# EasyEDA schematic Sound Activation Detector.json
TITLE: Sheet_1; REV: 1.0; Date: 2021-08-31; Sheet: 1/1; Drawn By: confusedtx5; Company: Your Company
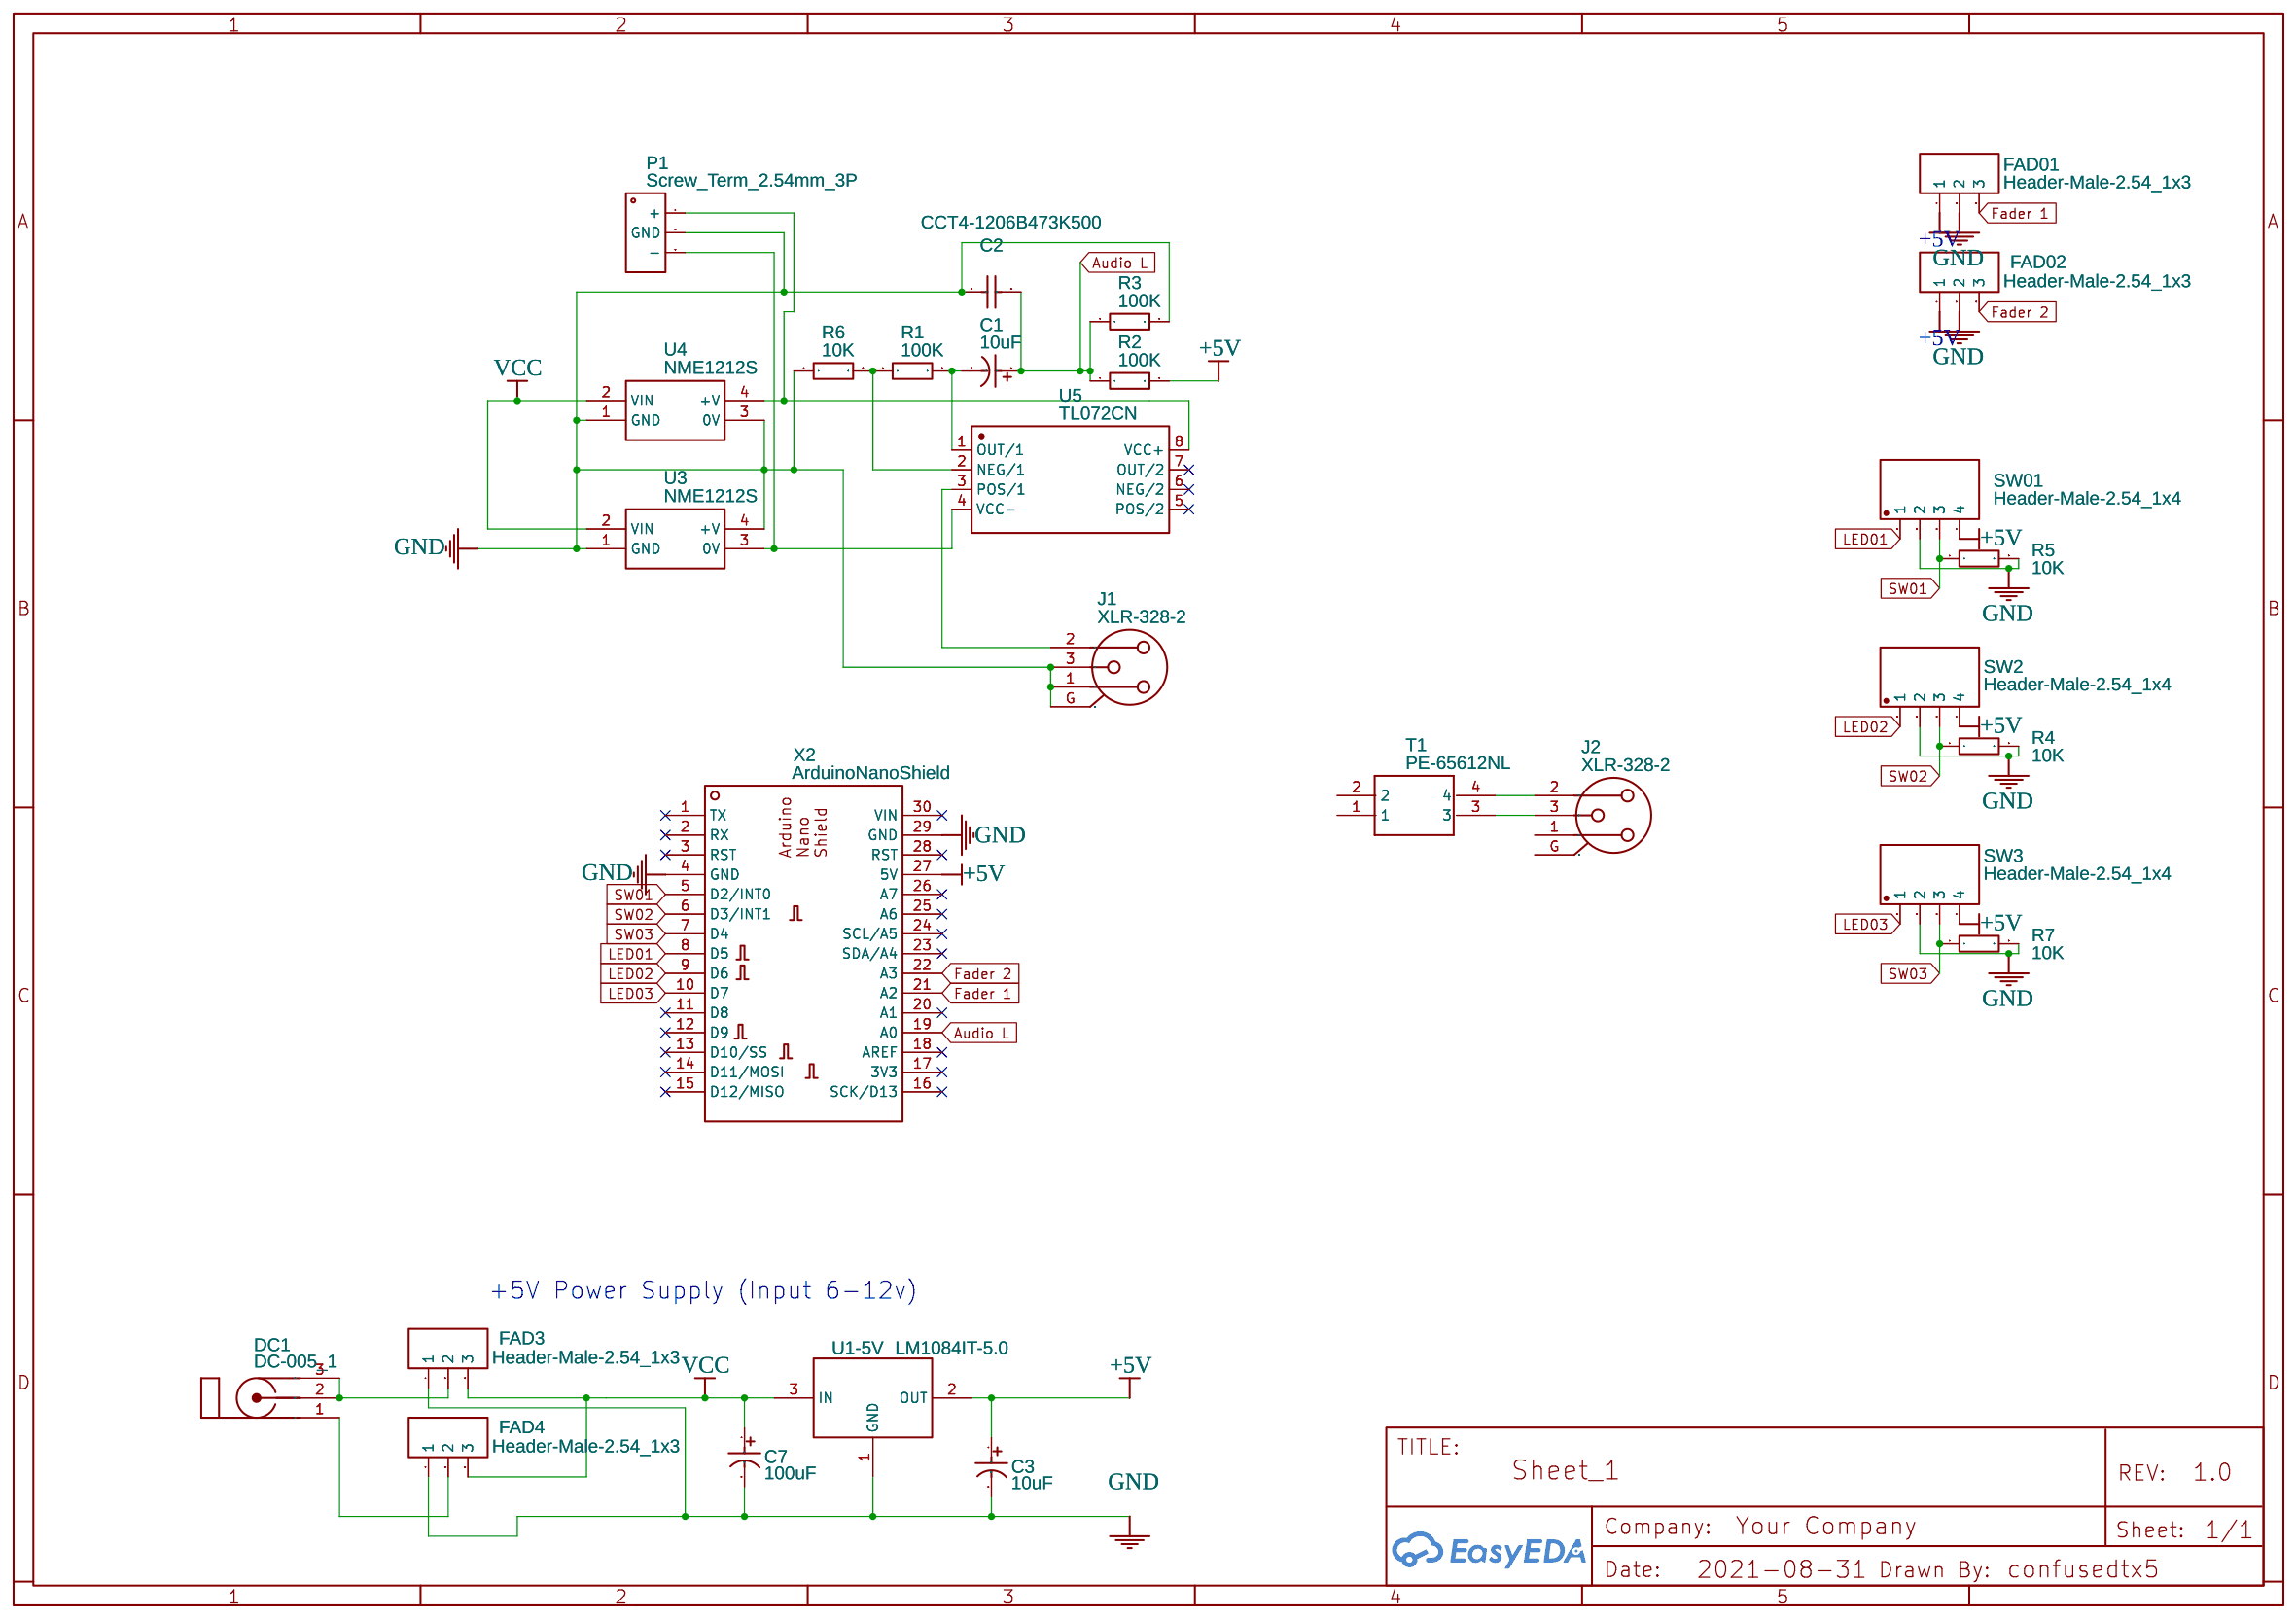
[diagram p0: schematic sheet]

## Parts
C1  10uF  [CAP-TH_BD6.3-P2.50-D1.0-FD]
C2  CCT4-1206B473K500  [CAP-TH_L8.0-W4.0-P5.00-D0.7]
C3  10uF  [CAP-D5.0XF2.0]
C7  100uF  [CAP-8*5]
DC1  DC-005_1  [DC-5020]
FAD01  Header-Male-2.54_1x3  [HDR-TH_3P-P2.54-V-M-1]
FAD02  Header-Male-2.54_1x3  [HDR-TH_3P-P2.54-V-M-1]
FAD3  Header-Male-2.54_1x3  [HDR-TH_3P-P2.54-V-M-1]
FAD4  Header-Male-2.54_1x3  [HDR-TH_3P-P2.54-V-M-1]
J1  XLR-328-2  [CONN-TH_XLR-328-2]
J2  XLR-328-2  [CONN-TH_XLR-328-2]
P1  Screw_Term_2.54mm_3P  [SCREW_TERMINAL_2.54_1X3]
R1  100K  [RES-TH_BD3.3-L9.0-P13.00-D0.6]
R2  100K  [RES-TH_BD3.3-L9.0-P13.00-D0.6]
R3  100K  [RES-TH_BD3.3-L9.0-P13.00-D0.6]
R4  10K  [RES-TH_BD3.3-L9.0-P13.00-D0.6]
R5  10K  [RES-TH_BD3.3-L9.0-P13.00-D0.6]
R6  10K  [RES-TH_BD3.3-L9.0-P13.00-D0.6]
R7  10K  [RES-TH_BD3.3-L9.0-P13.00-D0.6]
SW01  Header-Male-2.54_1x4  [HDR-TH_4P-P2.54-V-M]
SW2  Header-Male-2.54_1x4  [HDR-TH_4P-P2.54-V-M]
SW3  Header-Male-2.54_1x4  [HDR-TH_4P-P2.54-V-M]
T1  PE-65612NL  [PE65612NL]
U1-5V  LM1084IT-5.0  [TO-220-3_L10.0-W4.5-P2.54-L]
U3  NME1212S  [NPSIP4]
U4  NME1212S  [NPSIP4]
U5  TL072CN  [DIP-8_L9.4-W6.4-P2.54-LS9.1-BL]
X2  ArduinoNanoShield  [ARDUINONANOSHIELD]

## Library data of the parts
C1 = 10uf/100V: Supplier: LCSC; Manufacturer: ValuePro; Supplier Part: C2029; JLCPCB Part Class: Extended Part
C2 = CCT4-1206B473K500: Supplier Part: C32275; Supplier: LCSC; Manufacturer: ReliaPro
C3 = -: Voltage: 25V; Supplier: LCSC; Manufacturer: ValuePro; Manufacturer Part: 10uF 25V RHOS; Supplier Part: C19576
C7 = -: Voltage: 25V; Supplier: LCSC; Manufacturer Part: 100uF 25V; Manufacturer: ReliaPro; Supplier Part: C13376
DC1 = -: LCSC: E66437; Supplier: EasyEDA; Manufacturer: EasyEDA
FAD01 FAD02-FAD4 = Header-Male-2.54_1x3: Supplier: LCSC; Manufacturer: BOOMELE; Manufacturer Part: Header2.54mm 1*3P; Supplier Part: C49257; JLCPCB Part Class: Extended Part
J1 J2 = XLR-328-2: Supplier: LCSC; Supplier Part: C309331; Manufacturer: HOOYA; Contributor: LCSC; JLCPCB Part Class: Extended Part
P1 = Screw_Term_2.54mm_3P: Supplier Part: undefined; Contributor: largevodkaredbull
R1-R3 = MFR0S2F1003A20: Supplier: LCSC; Manufacturer: UniOhm; Supplier Part: C58589; JLCPCB Part Class: Extended Part
R4-R7 = MF1/2W-10KΩ±1% T52: Supplier: LCSC; Supplier Part: C119433; Manufacturer: Chian Chia Elec; Contributor: LCSC; JLCPCB Part Class: Extended Part
SW01-SW3 = Header-Male-2.54_1x4: Supplier: LCSC; Manufacturer: Ckmtw; Manufacturer Part: 210S-1*4P L=11.6MMGold-plated black; Contributor: LCSC; Supplier Part: C124378; JLCPCB Part Class: Extended Part
T1 = PE-65612NL: Contributor: sternjo
U1-5V = LM1084IT-5.0: Supplier: LCSC; Manufacturer: TI; Supplier Part: C9719; JLCPCB Part Class: Extended Part
U3 U4 = NME1212S: Isolated 1W Single Output
U5 = TL072CN: Supplier: LCSC; Manufacturer: STMicroelectronics; Supplier Part: C5164
X2 = ArduinoNanoShield: Contributor: BauerTechnology

## Nets
+5V: C3.1 FAD01.1 FAD02.1 R2.2 SW01.4 SW2.4 SW3.4 U1-5V.2(OUT) X2.27(5V)
GND: C2.1 C3.2 C7.2 FAD01.2 FAD02.2 FAD3.1 FAD4.1 J1.1 J1.3 J1.G P1.2(GND) R3.2 R4.2 R5.2 R6.1 R7.2 SW01.2 SW2.2 SW3.2 U1-5V.1(GND) U3.1(GND) U3.4(+V) U4.1(GND) U4.3(0V) X2.4(GND) X2.29(GND)
VCC: C7.1 FAD3.3 FAD4.3 U1-5V.3(IN) U3.2(VIN) U4.2(VIN)
Audio L: C1.1 C2.2 R2.1 R3.1 X2.19(A0)
Fader 1: FAD01.3 X2.21(A2)
Fader 2: FAD02.3 X2.22(A3)
LED01: SW01.1 X2.8(D5)
LED02: SW2.1 X2.9(D6)
LED03: SW3.1 X2.10(D7)
SW01: R5.1 SW01.3 X2.5(D2/INT0)
SW02: R4.1 SW2.3 X2.6(D3/INT1)
SW03: R7.1 SW3.3 X2.7(D4)
Net-(C1-2): C1.2 R1.2 U5.1(OUT/1)
Net-(DC1-1): DC1.1 FAD4.2
Net-(DC1-2): DC1.2(VCC) DC1.3 FAD3.2
Net-(J1-2): J1.2 U5.3(POS/1)
Net-(J2-2): J2.2 T1.4
Net-(J2-3): J2.3 T1.3
Net-(P1-1): P1.1(+) U4.4(+V) U5.8(VCC+)
Net-(P1-3): P1.3(-) U3.3(0V) U5.4(VCC-)
Net-(R1-1): R1.1 R6.2 U5.2(NEG/1)

Not connected (* = marked no-connect by the designer): J2 1 G; T1 1 2; U5 5(POS/2)* 6(NEG/2)* 7(OUT/2)*; X2 1(TX)* 2(RX)* 3(RST)* 11(D8)* 12(D9)* 13(D10/SS)* 14(D11/MOSI)* 15(D12/MISO)* 16(SCK/D13)* 17(3V3)* 18(AREF)* 20(A1)* 23(SDA/A4)* 24(SCL/A5)* 25(A6)* 26(A7)* 28(RST)* 30(VIN)*

## Notes on the sheet
- +5V Power Supply (Input 6-12v)
